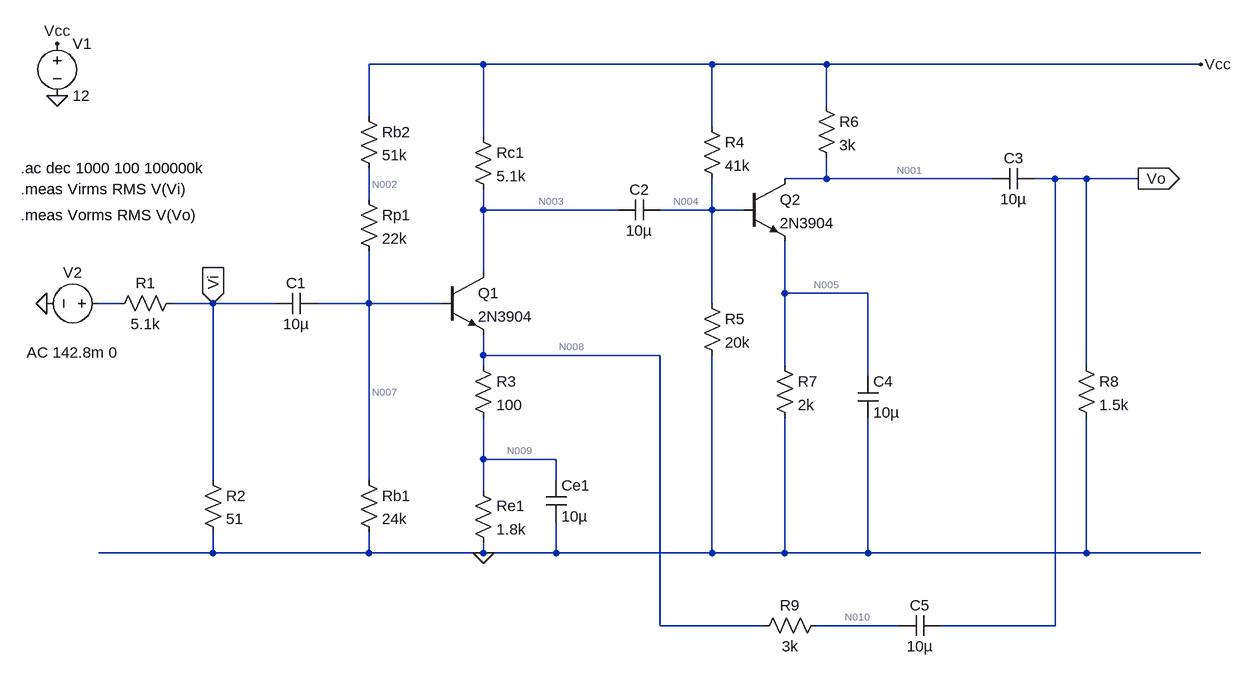
[diagram p0: schematic Experiment3_3_1.asc]
Experiment3_3_1.asc, the LTspice schematic file:
Version 4.1
SHEET 1 1192 680
WIRE 32 -240 -144 -240
WIRE 384 -240 32 -240
WIRE 560 -240 384 -240
WIRE 1136 -240 560 -240
WIRE 560 -176 560 -240
WIRE -144 -160 -144 -240
WIRE 384 -144 384 -240
WIRE 32 -128 32 -240
WIRE 560 -64 560 -96
WIRE 560 -64 496 -64
WIRE 816 -64 560 -64
WIRE 912 -64 880 -64
WIRE 960 -64 912 -64
WIRE 1040 -64 960 -64
WIRE -144 -32 -144 -80
WIRE 32 -16 32 -48
WIRE 240 -16 32 -16
WIRE 384 -16 384 -64
WIRE 384 -16 304 -16
WIRE 432 -16 384 -16
WIRE 32 80 32 -16
WIRE 496 112 496 32
WIRE 624 112 496 112
WIRE -528 128 -560 128
WIRE -384 128 -448 128
WIRE -288 128 -384 128
WIRE -144 128 -144 48
WIRE -144 128 -224 128
WIRE -32 128 -144 128
WIRE 384 128 384 -16
WIRE 32 208 32 176
WIRE 304 208 32 208
WIRE 32 224 32 208
WIRE 496 224 496 112
WIRE 960 224 960 -64
WIRE 624 240 624 112
WIRE 32 368 32 304
WIRE 144 368 32 368
WIRE -384 400 -384 128
WIRE -144 400 -144 128
WIRE 144 400 144 368
WIRE 32 416 32 368
WIRE -384 512 -384 480
WIRE -384 512 -560 512
WIRE -144 512 -144 480
WIRE -144 512 -384 512
WIRE 32 512 32 496
WIRE 32 512 -144 512
WIRE 144 512 144 464
WIRE 144 512 32 512
WIRE 384 512 384 208
WIRE 384 512 144 512
WIRE 496 512 496 304
WIRE 496 512 384 512
WIRE 624 512 624 304
WIRE 624 512 496 512
WIRE 960 512 960 304
WIRE 960 512 624 512
WIRE 1136 512 960 512
WIRE 304 624 304 208
WIRE 464 624 304 624
WIRE 672 624 544 624
WIRE 912 624 912 -64
WIRE 912 624 736 624
FLAG 32 512 0
FLAG 1136 -240 Vcc
FLAG -624 -272 Vcc
FLAG -624 -192 0
FLAG -640 128 0
FLAG 1040 -64 Vo
IOPIN 1040 -64 Out
FLAG -384 128 Vi
IOPIN -384 128 In
SYMBOL res -432 112 R90
WINDOW 0 0 56 VBottom 2
WINDOW 3 32 56 VTop 2
SYMATTR InstName R1
SYMATTR Value 5.1k
SYMBOL res -400 384 R0
SYMATTR InstName R2
SYMATTR Value 51
SYMBOL res -160 384 R0
SYMATTR InstName Rb1
SYMATTR Value 24k
SYMBOL res -160 -48 R0
SYMATTR InstName Rp1
SYMATTR Value 22k
SYMBOL res -160 -176 R0
SYMATTR InstName Rb2
SYMATTR Value 51k
SYMBOL npn -32 80 R0
SYMATTR InstName Q1
SYMATTR Value 2N3904
SYMBOL res 16 400 R0
SYMATTR InstName Re1
SYMATTR Value 1.8k
SYMBOL res 16 -144 R0
SYMATTR InstName Rc1
SYMATTR Value 5.1k
SYMBOL voltage -624 -288 R0
WINDOW 123 0 0 Left 0
WINDOW 39 0 0 Left 0
SYMATTR InstName V1
SYMATTR Value 12
SYMBOL cap -224 112 R90
WINDOW 0 0 32 VBottom 2
WINDOW 3 32 32 VTop 2
SYMATTR InstName C1
SYMATTR Value 10µ
SYMATTR SpiceLine V=6.3 Irms=0 Rser=4 Lser=0 mfg="AVX" pn="TAJA106M006" type="Tantalum"
SYMBOL cap 240 0 R270
WINDOW 0 32 32 VTop 2
WINDOW 3 0 32 VBottom 2
SYMATTR InstName C2
SYMATTR Value 10µ
SYMATTR SpiceLine V=6.3 Irms=0 Rser=4 Lser=0 mfg="AVX" pn="TAJA106M006" type="Tantalum"
SYMBOL cap 128 400 R0
SYMATTR Value 10µ
SYMATTR InstName Ce1
SYMATTR SpiceLine V=6.3 Irms=0 Rser=4 Lser=0 mfg="AVX" pn="TAJA106M006" type="Tantalum"
SYMBOL voltage -544 128 R90
WINDOW 0 -32 56 VBottom 2
WINDOW 3 32 56 VTop 2
WINDOW 123 60 56 VTop 2
WINDOW 39 0 0 Left 0
SYMATTR InstName V2
SYMATTR Value ""
SYMATTR Value2 AC 142.8m 0
SYMBOL res 16 208 R0
SYMATTR InstName R3
SYMATTR Value 100
SYMBOL res 368 -160 R0
SYMATTR InstName R4
SYMATTR Value 41k
SYMBOL res 368 112 R0
SYMATTR InstName R5
SYMATTR Value 20k
SYMBOL npn 432 -64 R0
SYMATTR InstName Q2
SYMATTR Value 2N3904
SYMBOL res 544 -192 R0
SYMATTR InstName R6
SYMATTR Value 3k
SYMBOL cap 816 -48 R270
WINDOW 0 32 32 VTop 2
WINDOW 3 0 32 VBottom 2
SYMATTR InstName C3
SYMATTR Value 10µ
SYMATTR SpiceLine V=6.3 Irms=0 Rser=4 Lser=0 mfg="AVX" pn="TAJA106M006" type="Tantalum"
SYMBOL res 480 208 R0
SYMATTR InstName R7
SYMATTR Value 2k
SYMBOL cap 608 240 R0
SYMATTR InstName C4
SYMATTR Value 10µ
SYMATTR SpiceLine V=6.3 Irms=0 Rser=4 Lser=0 mfg="AVX" pn="TAJA106M006" type="Tantalum"
SYMBOL res 944 208 R0
SYMATTR InstName R8
SYMATTR Value 1.5k
SYMBOL res 560 608 R90
WINDOW 0 0 56 VBottom 2
WINDOW 3 32 56 VTop 2
SYMATTR InstName R9
SYMATTR Value 3k
SYMBOL cap 672 640 R270
WINDOW 0 32 32 VTop 2
WINDOW 3 0 32 VBottom 2
SYMATTR InstName C5
SYMATTR Value 10µ
SYMATTR SpiceLine V=6.3 Irms=0 Rser=4 Lser=0 mfg="AVX" pn="TAJA106M006" type="Tantalum"
TEXT -680 -48 Left 2 !.meas Virms RMS V(Vi)
TEXT -680 -8 Left 2 !.meas Vorms RMS V(Vo)
TEXT -680 -80 Left 2 !.ac dec 1000 100 100000k

The netlist it stands for:
* Experiment3_3_1.asc
R1 Vi N006 5.1k
R2 Vi 0 51
Rb1 N007 0 24k
Rp1 N002 N007 22k
Rb2 Vcc N002 51k
Q1 N003 N007 N008 0 2N3904
Re1 N009 0 1.8k
Rc1 Vcc N003 5.1k
V1 Vcc 0 12
C1 N007 Vi 10µ V=6.3 Irms=0 Rser=4 Lser=0 mfg="AVX" pn="TAJA106M006" type="Tantalum"
C2 N003 N004 10µ V=6.3 Irms=0 Rser=4 Lser=0 mfg="AVX" pn="TAJA106M006" type="Tantalum"
Ce1 N009 0 10µ V=6.3 Irms=0 Rser=4 Lser=0 mfg="AVX" pn="TAJA106M006" type="Tantalum"
V2 N006 0 AC 142.8m 0
R3 N008 N009 100
R4 Vcc N004 41k
R5 N004 0 20k
Q2 N001 N004 N005 0 2N3904
R6 Vcc N001 3k
C3 N001 Vo 10µ V=6.3 Irms=0 Rser=4 Lser=0 mfg="AVX" pn="TAJA106M006" type="Tantalum"
R7 N005 0 2k
C4 N005 0 10µ V=6.3 Irms=0 Rser=4 Lser=0 mfg="AVX" pn="TAJA106M006" type="Tantalum"
R8 Vo 0 1.5k
R9 N010 N008 3k
C5 N010 Vo 10µ V=6.3 Irms=0 Rser=4 Lser=0 mfg="AVX" pn="TAJA106M006" type="Tantalum"
.model NPN NPN
.model PNP PNP
.lib standard.bjt
.meas Virms RMS V(Vi)
.meas Vorms RMS V(Vo)
.ac dec 1000 100 100000k
.backanno
.end

* Results of the author's LTspice run, read from the files saved beside the schematic
* Operating Point, zero values left out:
*   V(n002) = 5.643 V
*   V(vcc) = 12 V
*   V(n008) = 2.241 V
*   V(n001) = 7.218 V
*   V(n010) = 2.241 V
*   V(n007) = 2.9 V
*   V(n003) = 6.003 V
*   V(n009) = 2.123 V
*   V(n004) = 3.865 V
*   V(n005) = 3.198 V
*   Ic(Q1) = 1.176 mA
*   Ib(Q1) = 3.812 µA
*   Ie(Q1) = -1.18 mA
*   I(R3) = 1.18 mA
*   I(R5) = 193.3 µA
*   I(Rb1) = 120.8 µA
*   I(Rb2) = 124.7 µA
*   I(Rc1) = 1.176 mA
*   I(Rp1) = 124.7 µA
*   I(Re1) = 1.18 mA
*   I(V1) = -3.093 mA
*   I(R4) = 198.4 µA
*   Ic(Q2) = 1.594 mA
*   Ib(Q2) = 5.161 µA
*   Ie(Q2) = -1.599 mA
*   I(R6) = 1.594 mA
*   I(R7) = 1.599 mA
* From the log:
*   virms: RMS(V(Vi))=0.00137107434933 FROM 100 TO 100000000
*   vorms: RMS(V(Vo))=0.0189070524537 FROM 100 TO 100000000